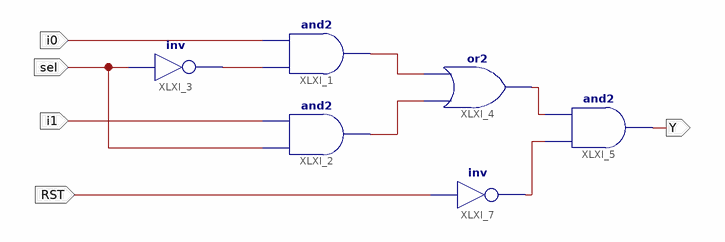
[diagram p0: schematic sheet 1]
// Xilinx ISE schematic mux2to1.sch (artix7) as structural Verilog: 6 symbols, 5 ports
module mux2to1 (
  input  i0,
  input  i1,
  input  sel,
  input  RST,
  output Y
);

  wire XLXN_1, XLXN_2, XLXN_4, XLXN_6, XLXN_7;

  and XLXI_1 (XLXN_2, XLXN_1, i0);
  and XLXI_2 (XLXN_4, sel, i1);
  not XLXI_3 (XLXN_1, sel);
  or XLXI_4 (XLXN_6, XLXN_4, XLXN_2);
  and XLXI_5 (Y, XLXN_7, XLXN_6);
  not XLXI_7 (XLXN_7, RST);
endmodule
